# Altium schematic sheet SKC_Display.SchDoc: SKC Display
size A3; Author: eldar6776@hotmail.com; DrawnBy: Eldar Dediæ; Organization: PROVEN d.o.o.; Address1: Adema Buæe 102; Address2: 71000 Sarajevo; Address3: Federacija BiH; Address4: Bosna i Hercegovina; DocumentNumber: DE211213; Revision: 001; SheetNumber: 13; SheetTotal: 15; ProjectName: MIKSER SIROVINE
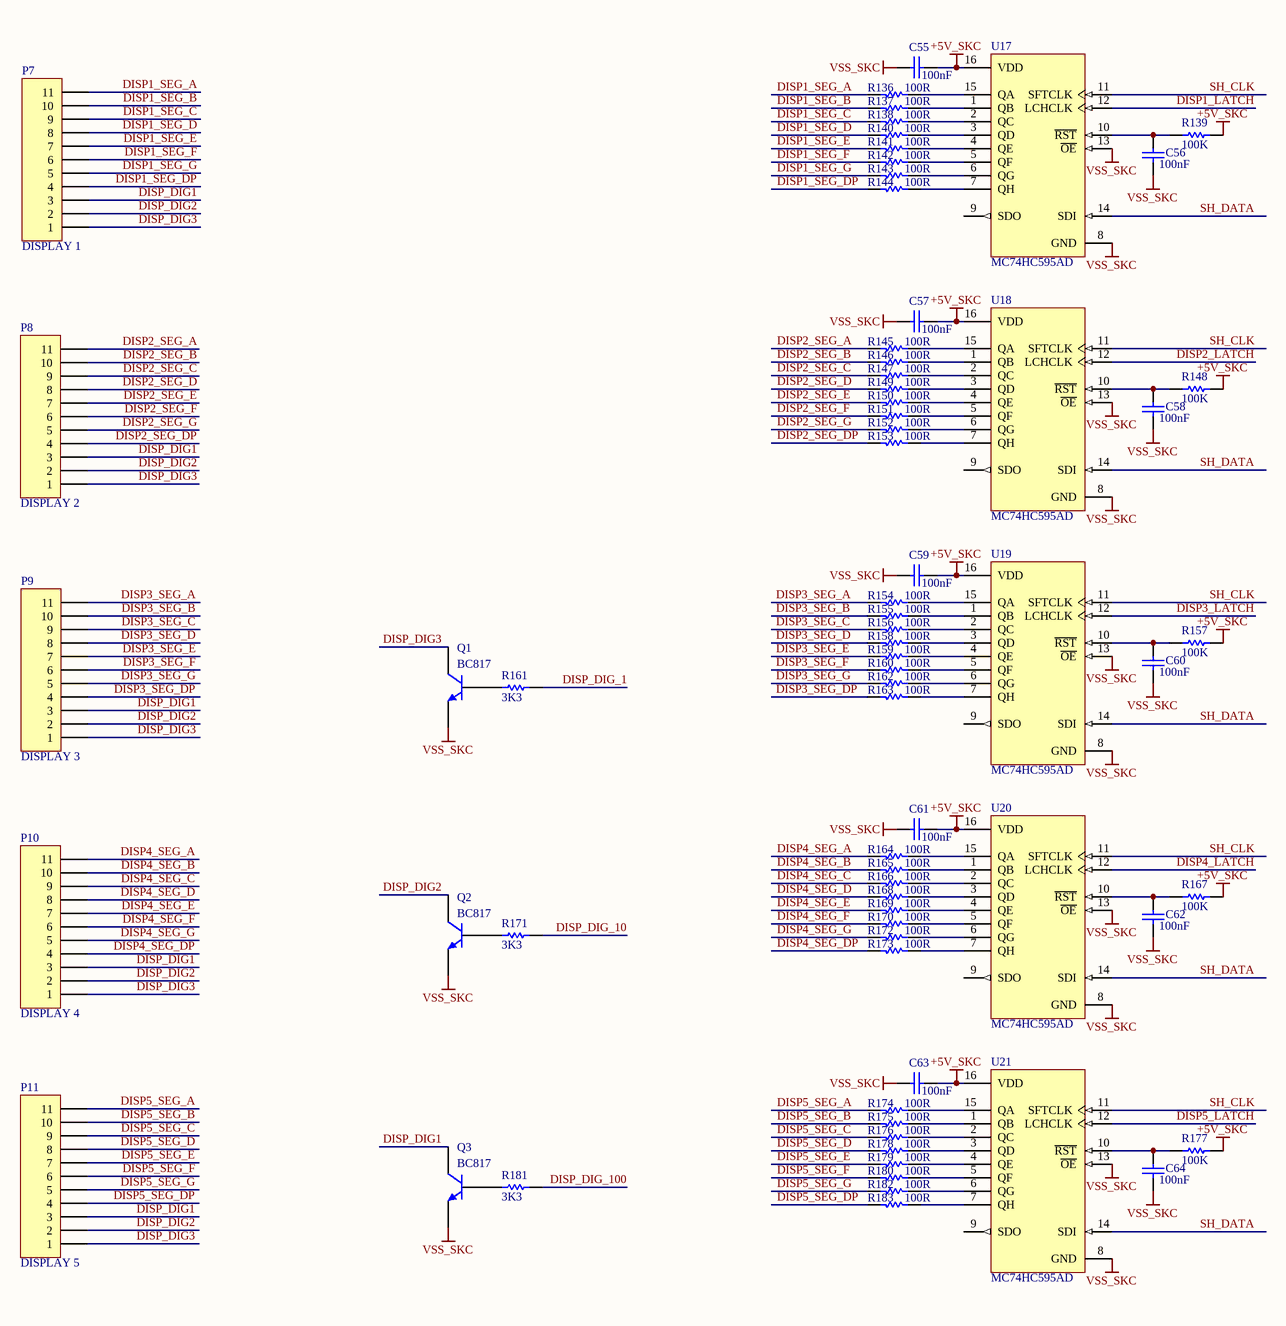
[diagram p0: SKC_Display.SchDoc]

## Parts
C55  value 100nF  [1206]
C56  value 100nF  [1206]
C57  value 100nF  [1206]
C58  value 100nF  [1206]
C59  value 100nF  [1206]
C60  value 100nF  [1206]
C61  value 100nF  [1206]
C62  value 100nF  [1206]
C63  value 100nF  [1206]
C64  value 100nF  [1206]
P7  DISPLAY 1  [HDR1X11]
P8  DISPLAY 2  [HDR1X11]
P9  DISPLAY 3  [HDR1X11]
P10  DISPLAY 4  [HDR1X11]
P11  DISPLAY 5  [HDR1X11]
Q1  BC817  [SOT23_N]
Q2  BC817  [SOT23_N]
Q3  BC817  [SOT23_N]
R136  100R  [ERA-0603]
R137  100R  [ERA-0603]
R138  100R  [ERA-0603]
R139  100K  [ERA-0603]
R140  100R  [ERA-0603]
R141  100R  [ERA-0603]
R142  100R  [ERA-0603]
R143  100R  [ERA-0603]
R144  100R  [ERA-0603]
R145  100R  [ERA-0603]
R146  100R  [ERA-0603]
R147  100R  [ERA-0603]
R148  100K  [ERA-0603]
R149  100R  [ERA-0603]
R150  100R  [ERA-0603]
R151  100R  [ERA-0603]
R152  100R  [ERA-0603]
R153  100R  [ERA-0603]
R154  100R  [ERA-0603]
R155  100R  [ERA-0603]
R156  100R  [ERA-0603]
R157  100K  [ERA-0603]
R158  100R  [ERA-0603]
R159  100R  [ERA-0603]
R160  100R  [ERA-0603]
R161  3K3  [ERA-0603]
R162  100R  [ERA-0603]
R163  100R  [ERA-0603]
R164  100R  [ERA-0603]
R165  100R  [ERA-0603]
R166  100R  [ERA-0603]
R167  100K  [ERA-0603]
R168  100R  [ERA-0603]
R169  100R  [ERA-0603]
R170  100R  [ERA-0603]
R171  3K3  [ERA-0603]
R172  100R  [ERA-0603]
R173  100R  [ERA-0603]
R174  100R  [ERA-0603]
R175  100R  [ERA-0603]
R176  100R  [ERA-0603]
R177  100K  [ERA-0603]
R178  100R  [ERA-0603]
R179  100R  [ERA-0603]
R180  100R  [ERA-0603]
R181  3K3  [ERA-0603]
R182  100R  [ERA-0603]
R183  100R  [ERA-0603]
U17  MC74HC595AD  [751B-05_N]
U18  MC74HC595AD  [751B-05_N]
U19  MC74HC595AD  [751B-05_N]
U20  MC74HC595AD  [751B-05_N]
U21  MC74HC595AD  [751B-05_N]

## Nets
+5V_SKC: C55.1 C57.1 C59.1 C61.1 C63.1 R139.2 R148.2 R157.2 R167.2 R177.2 U17.16(VDD) U18.16(VDD) U19.16(VDD) U20.16(VDD) U21.16(VDD)
VSS_SKC: C55.2 C56.1 C57.2 C58.1 C59.2 C60.1 C61.2 C62.1 C63.2 C64.1 Q1.2(E) Q2.2(E) Q3.2(E) U17.8(GND) U17.13(~{OE}) U18.8(GND) U18.13(~{OE}) U19.8(GND) U19.13(~{OE}) U20.8(GND) U20.13(~{OE}) U21.8(GND) U21.13(~{OE})
DISP1_LATCH: U17.12(LCHCLK)
DISP1_SEG_A: P7.11 R136.2
DISP1_SEG_B: P7.10 R137.2
DISP1_SEG_C: P7.9 R138.2
DISP1_SEG_D: P7.8 R140.2
DISP1_SEG_DP: P7.4 R144.2
DISP1_SEG_E: P7.7 R141.2
DISP1_SEG_F: P7.6 R142.2
DISP1_SEG_G: P7.5 R143.2
DISP2_LATCH: U18.12(LCHCLK)
DISP2_SEG_A: P8.11 R145.2
DISP2_SEG_B: P8.10 R146.2
DISP2_SEG_C: P8.9 R147.2
DISP2_SEG_D: P8.8 R149.2
DISP2_SEG_DP: P8.4 R153.2
DISP2_SEG_E: P8.7 R150.2
DISP2_SEG_F: P8.6 R151.2
DISP2_SEG_G: P8.5 R152.2
DISP3_LATCH: U19.12(LCHCLK)
DISP3_SEG_A: P9.11 R154.2
DISP3_SEG_B: P9.10 R155.2
DISP3_SEG_C: P9.9 R156.2
DISP3_SEG_D: P9.8 R158.2
DISP3_SEG_DP: P9.4 R163.2
DISP3_SEG_E: P9.7 R159.2
DISP3_SEG_F: P9.6 R160.2
DISP3_SEG_G: P9.5 R162.2
DISP4_LATCH: U20.12(LCHCLK)
DISP4_SEG_A: P10.11 R164.2
DISP4_SEG_B: P10.10 R165.2
DISP4_SEG_C: P10.9 R166.2
DISP4_SEG_D: P10.8 R168.2
DISP4_SEG_DP: P10.4 R173.2
DISP4_SEG_E: P10.7 R169.2
DISP4_SEG_F: P10.6 R170.2
DISP4_SEG_G: P10.5 R172.2
DISP5_LATCH: U21.12(LCHCLK)
DISP5_SEG_A: P11.11 R174.2
DISP5_SEG_B: P11.10 R175.2
DISP5_SEG_C: P11.9 R176.2
DISP5_SEG_D: P11.8 R178.2
DISP5_SEG_DP: P11.4 R183.2
DISP5_SEG_E: P11.7 R179.2
DISP5_SEG_F: P11.6 R180.2
DISP5_SEG_G: P11.5 R182.2
DISP_DIG1: P7.3 P8.3 P9.3 P10.3 P11.3 Q3.3(C)
DISP_DIG2: P7.2 P8.2 P9.2 P10.2 P11.2 Q2.3(C)
DISP_DIG3: P7.1 P8.1 P9.1 P10.1 P11.1 Q1.3(C)
DISP_DIG_1: R161.2
DISP_DIG_10: R171.2
DISP_DIG_100: R181.2
SH_CLK: U17.11(SFTCLK) U18.11(SFTCLK) U19.11(SFTCLK) U20.11(SFTCLK) U21.11(SFTCLK)
SH_DATA: U17.14(SDI) U18.14(SDI) U19.14(SDI) U20.14(SDI) U21.14(SDI)
NetC56_2: C56.2 R139.1 U17.10(~{RST})
NetC58_2: C58.2 R148.1 U18.10(~{RST})
NetC60_2: C60.2 R157.1 U19.10(~{RST})
NetC62_2: C62.2 R167.1 U20.10(~{RST})
NetC64_2: C64.2 R177.1 U21.10(~{RST})
NetQ1_1: Q1.1(B) R161.1
NetQ2_1: Q2.1(B) R171.1
NetQ3_1: Q3.1(B) R181.1
NetR136_1: R136.1 U17.15(QA)
NetR137_1: R137.1 U17.1(QB)
NetR138_1: R138.1 U17.2(QC)
NetR140_1: R140.1 U17.3(QD)
NetR141_1: R141.1 U17.4(QE)
NetR142_1: R142.1 U17.5(QF)
NetR143_1: R143.1 U17.6(QG)
NetR144_1: R144.1 U17.7(QH)
NetR145_1: R145.1 U18.15(QA)
NetR146_1: R146.1 U18.1(QB)
NetR147_1: R147.1 U18.2(QC)
NetR149_1: R149.1 U18.3(QD)
NetR150_1: R150.1 U18.4(QE)
NetR151_1: R151.1 U18.5(QF)
NetR152_1: R152.1 U18.6(QG)
NetR153_1: R153.1 U18.7(QH)
NetR154_1: R154.1 U19.15(QA)
NetR155_1: R155.1 U19.1(QB)
NetR156_1: R156.1 U19.2(QC)
NetR158_1: R158.1 U19.3(QD)
NetR159_1: R159.1 U19.4(QE)
NetR160_1: R160.1 U19.5(QF)
NetR162_1: R162.1 U19.6(QG)
NetR163_1: R163.1 U19.7(QH)
NetR164_1: R164.1 U20.15(QA)
NetR165_1: R165.1 U20.1(QB)
NetR166_1: R166.1 U20.2(QC)
NetR168_1: R168.1 U20.3(QD)
NetR169_1: R169.1 U20.4(QE)
NetR170_1: R170.1 U20.5(QF)
NetR172_1: R172.1 U20.6(QG)
NetR173_1: R173.1 U20.7(QH)
NetR174_1: R174.1 U21.15(QA)
NetR175_1: R175.1 U21.1(QB)
NetR176_1: R176.1 U21.2(QC)
NetR178_1: R178.1 U21.3(QD)
NetR179_1: R179.1 U21.4(QE)
NetR180_1: R180.1 U21.5(QF)
NetR182_1: R182.1 U21.6(QG)
NetR183_1: R183.1 U21.7(QH)

Not connected (* = marked no-connect by the designer): U17 9(SDO); U18 9(SDO); U19 9(SDO); U20 9(SDO); U21 9(SDO)

## Notes on the sheet
- Title
- Size:
- Date:
- A3
- Number:
- Time:
- Revision:
- Sheet
- of
- File:

## Library data of the parts
C55-C64 = C1206: Ceramic Chip Capacitor - Standard; Published: 17-Jul-2002; LatestRevisionDate: 19-Mar-2004; LatestRevisionNote: Silkscreen size reduced.; DatasheetDocument: Mar-2001; PackageDocument: Mar-2001; PackageReference: 1206; Publisher: Altium Limited; Code_JEITA: 1206; Code_IPC: 3216 [1206]; ComponentLink1Description: Manufacturer Link; ComponentLink1URL: http://www.kemet.com/; ComponentLink2Description: Datasheet; ComponentLink2URL: http://www.kemet.com/kemet/web/homepage/kechome.nsf/vapubfilesname/F3102TA.pdf/$file/F3102TA.pdf
P7-P11 = Header 11: Header, 11-Pin; LatestRevisionDate: 17-Jul-2002; LatestRevisionNote: Re-released for DXP Platform.; Publisher: Altium Limited
Q1-Q3 = BC817: NPN General-purpose Transistor; Published: 17-Sep-2003; LatestRevisionDate: 12-Dec-2006; LatestRevisionNote: IPC-7351 Footprint Added.; DatasheetVersion: Jun-1999; PackageVersion: May-1999; PackageReference: SOT23; Publisher: Altium Limited; PackageDescription: 3-Pin SOT-23 Package 0.95 mm Pitch, 2.3 mm Lead Span; ComponentLink1Description: Manufacturer Link; ComponentLink1URL: http://www.semiconductors.philips.com/; ComponentLink2Description: Datasheet; ComponentLink2URL: http://www.semiconductors.philips.com/acrobat/datasheets/BC817_BC817W_BC337_5.pdf
R136-R183 = ERA3Y: Rectangular Thick Film Chip Resistor, 10 Ohm to 330k Ohm Range, 0.1% and 0.5% Tolerance, 0603 Size, 0.063 W; Note: If flow soldering, adjust pad width of PCB Footprint to 0.7 - 0.8 times the width of the resistor.; Published: 17-Dec-2003; LatestRevisionDate: 19-Mar-2004; LatestRevisionNote: Silkscreen size reduced.; PackageDocument: Mar-2003; PackageReference: ERA-0603; Publisher: Altium Limited; Code_IPC: 1608 [0603]; ComponentLink1Description: Manufacturer Link; ComponentLink1URL: http://www.panasonic.com/industrial/components/resistive_products.htm; ComponentLink2Description: Datasheet; ComponentLink2URL: http://www.panasonic.com/industrial/components/pdf/AOA0000CE8.pdf
U17-U21 = MC74HC595AD: 8-Bit Serial-Input/Serial or Prallel-Output Shift Register with Latched 3-State Outputs; Published: 15-Apr-2002; LatestRevisionDate: 13-Apr-2006; LatestRevisionNote: IPC-7351 Footprint Added.; DatasheetVersion: Mar-2000; PackageVersion: Oct-1999; PackageReference: 751B-05; Publisher: Altium Limited; PackageDescription: 16-Pin Small Outline Integrated Circuit 1.27 mm Pitch; Code_JEDEC: MS-012-AC; Code_IPC: SOIC127P600-16; ComponentLink1Description: Manufacturer Link; ComponentLink1URL: http://www.onsemi.com/; ComponentLink2Description: Datasheet; ComponentLink2URL: http://www.onsemi.com/pub/Collateral/MC74HC595A-D.PDF